# Altium schematic sheet Sheet5.SchDoc
size A4; SheetNumber: 5; SheetTotal: 5
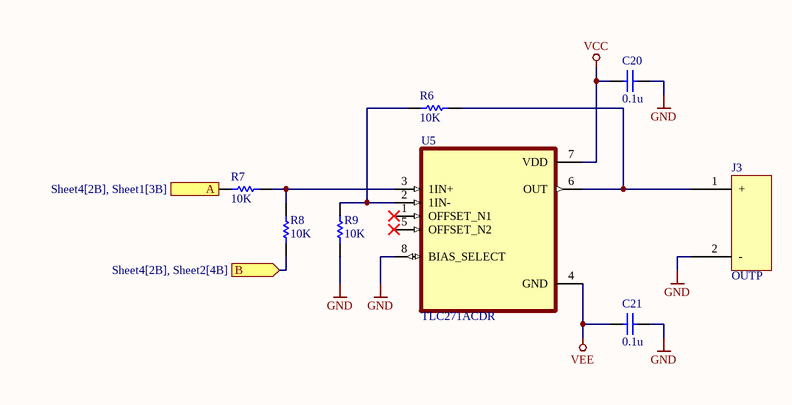
[diagram p0: Sheet5.SchDoc]

## Parts
C20  value 0.1u  [CAPC2012X150N]  (hidden comment: Capacitor)
C21  value 0.1u  [CAPC2012X150N]  (hidden comment: Capacitor)
J3  OUTP  [JST_B2B-XH-A_(LF)(SN)]
R6  value 10K  [RES_ERA6AHD330V]  (hidden comment: Resistor)
R7  value 10K  [RES_ERA6AHD330V]  (hidden comment: Resistor)
R8  value 10K  [RES_ERA6AHD330V]  (hidden comment: Resistor)
R9  value 10K  [RES_ERA6AHD330V]  (hidden comment: Resistor)
U5  TLC271ACDR  [SOIC127P599X175-8N]

## Ports
A (in, see Sheet4[2B], Sheet1[3B]), B (in, see Sheet4[2B], Sheet2[4B])

## Nets
GND: C20.1 C21.1 J3.2(-) R9.1 U5.8(BIAS_SELECT)
VCC: C20.2 U5.7(VDD)
VEE: C21.2 U5.4(GND)
A: R7.2 ; port A
B: R8.1 ; port B
NetJ3_1: J3.1(+) R6.2 U5.6(OUT)
NetR6_1: R6.1 R9.2 U5.2(1IN-)
NetR7_1: R7.1 R8.2 U5.3(1IN+)

Not connected (* = marked no-connect by the designer): U5 1(OFFSET_N1)* 5(OFFSET_N2)*

## Library data of the parts
C20 C21 = Capacitor: SimulationGenericComponent: True
R6-R9 = Resistor: TC1: 0; SimulationGenericComponent: True; TC2: 0
U5 = TLC271ACDR: Single, 16-V, 2-MHz, 5-mV offset voltage, In to V- operational amplifier; MF: Texas Instruments; SnapEDA_Link: https://www.snapeda.com/parts/TLC271ACDR/Texas+Instruments/view-part/?ref=snap; Package: SOIC-8 Texas Instruments; Value: *; MP: TLC271ACDR; Check_prices: https://www.snapeda.com/parts/TLC271ACDR/Texas+Instruments/view-part/?ref=eda